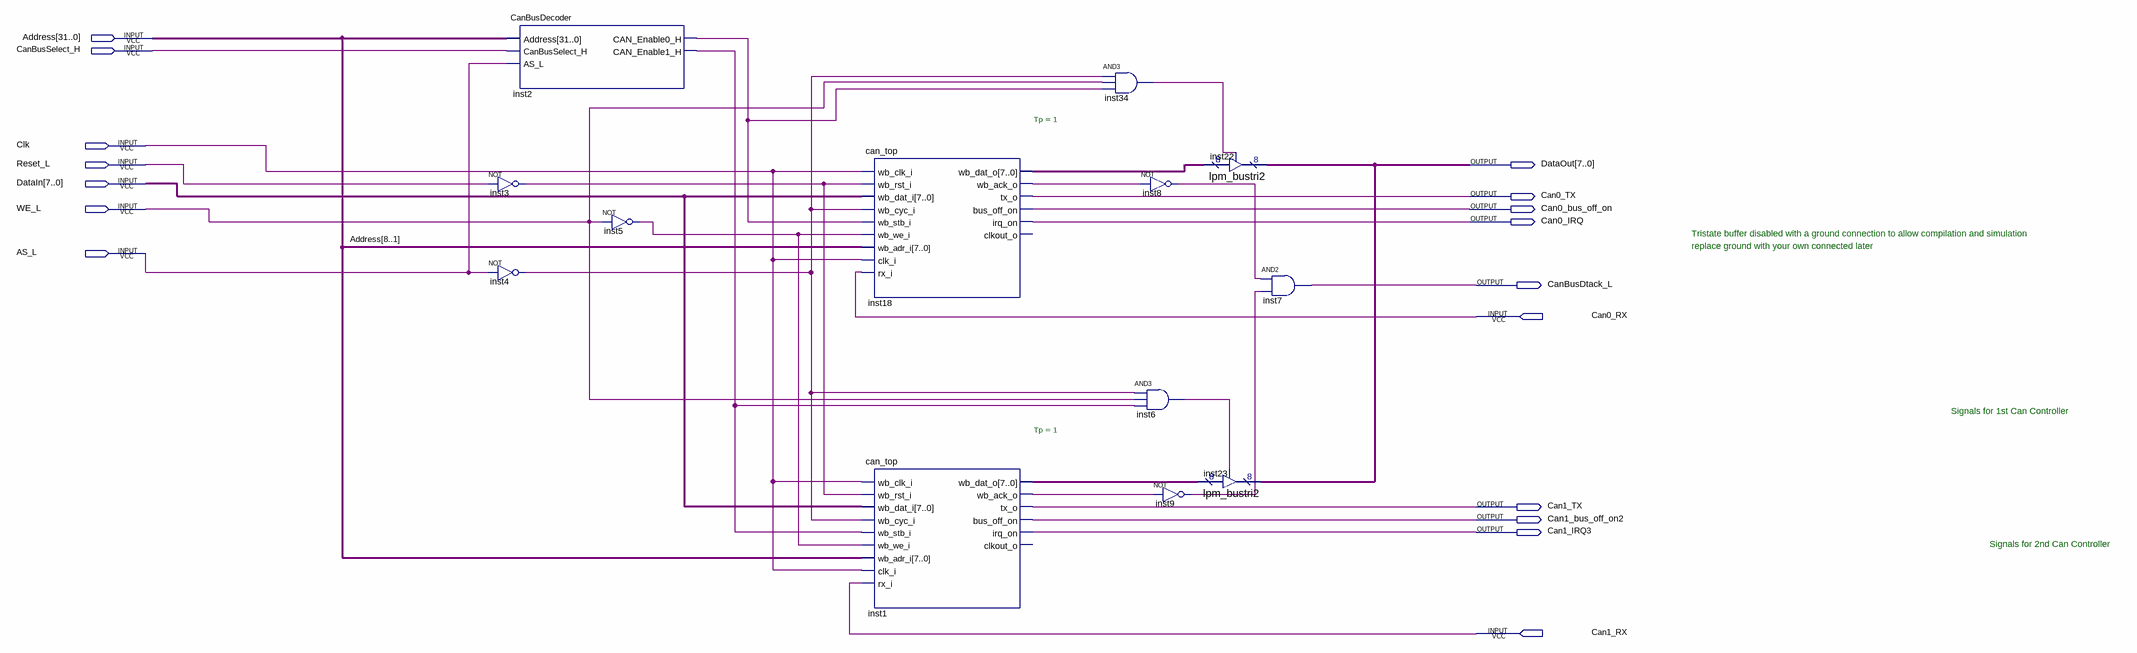
[diagram p0: schematic sheet]
// Quartus schematic CanBus.bdf as structural Verilog: 13 symbols, 17 pins
module CanBus (
  input  [31:0] Address,
  input  CanBusSelect_H,
  input  Clk,
  input  Reset_L,
  input  [7:0] DataIn,
  input  WE_L,
  input  AS_L,
  input  Can0_RX,
  input  Can1_RX,
  output [7:0] DataOut,
  output Can0_TX,
  output Can0_bus_off_on,
  output Can0_IRQ,
  output CanBusDtack_L,
  output Can1_TX,
  output Can1_bus_off_on2,
  output Can1_IRQ3
);

  wire inst1_wb_ack_o, inst2_can_enable0_h, inst2_can_enable1_h, inst3_out, inst4_out, inst5_out, inst6_out,
       inst8_out, inst9_out, inst18_wb_ack_o, inst34_out;
  wire [7:0] inst1_wb_dat_o, inst18_wb_dat_o;

  CanBusDecoder inst2 (
    .Address(Address), .CanBusSelect_H(CanBusSelect_H), .AS_L(AS_L), .CAN_Enable0_H(inst2_can_enable0_h),
    .CAN_Enable1_H(inst2_can_enable1_h));
  not inst3 (inst3_out, Reset_L);
  not inst4 (inst4_out, AS_L);
  not inst5 (inst5_out, WE_L);
  can_top #(.Tp(1)) inst18 (
    .wb_clk_i(Clk), .wb_rst_i(inst3_out), .wb_dat_i(DataIn), .wb_cyc_i(inst4_out),
    .wb_stb_i(inst2_can_enable0_h), .wb_we_i(inst5_out), .wb_adr_i(Address[8:1]), .clk_i(Clk),
    .rx_i(Can0_RX), .wb_dat_o(inst18_wb_dat_o), .wb_ack_o(inst18_wb_ack_o), .tx_o(Can0_TX),
    .bus_off_on(Can0_bus_off_on), .irq_on(Can0_IRQ));  // open: clkout_o
  can_top #(.Tp(1)) inst1 (
    .wb_clk_i(Clk), .wb_rst_i(inst3_out), .wb_dat_i(DataIn), .wb_cyc_i(inst4_out),
    .wb_stb_i(inst2_can_enable1_h), .wb_we_i(inst5_out), .wb_adr_i(Address), .clk_i(Clk), .rx_i(Can1_RX),
    .wb_dat_o(inst1_wb_dat_o), .wb_ack_o(inst1_wb_ack_o), .tx_o(Can1_TX), .bus_off_on(Can1_bus_off_on2),
    .irq_on(Can1_IRQ3));  // open: clkout_o
  and inst34 (inst34_out, inst4_out, WE_L, inst2_can_enable0_h);
  and inst6 (inst6_out, inst4_out, WE_L, inst2_can_enable1_h);
  not inst8 (inst8_out, inst18_wb_ack_o);
  not inst9 (inst9_out, inst1_wb_ack_o);
  lpm_bustri2 inst22 (.enabledt(inst34_out), .data(inst18_wb_dat_o), .tridata(DataOut));
  lpm_bustri2 inst23 (.enabledt(inst6_out), .data(inst1_wb_dat_o), .tridata(DataOut));
  and inst7 (CanBusDtack_L, inst8_out, inst9_out);

  // Notes on the sheet:
  //   Tristate buffer disabled with a ground connection to allow compilation and simulation
  //   replace ground with your own connected later
  //   Signals for 1st Can Controller
  //   Signals for 2nd Can Controller
endmodule
